# Altium schematic sheet PORTS.SchDoc
size A4
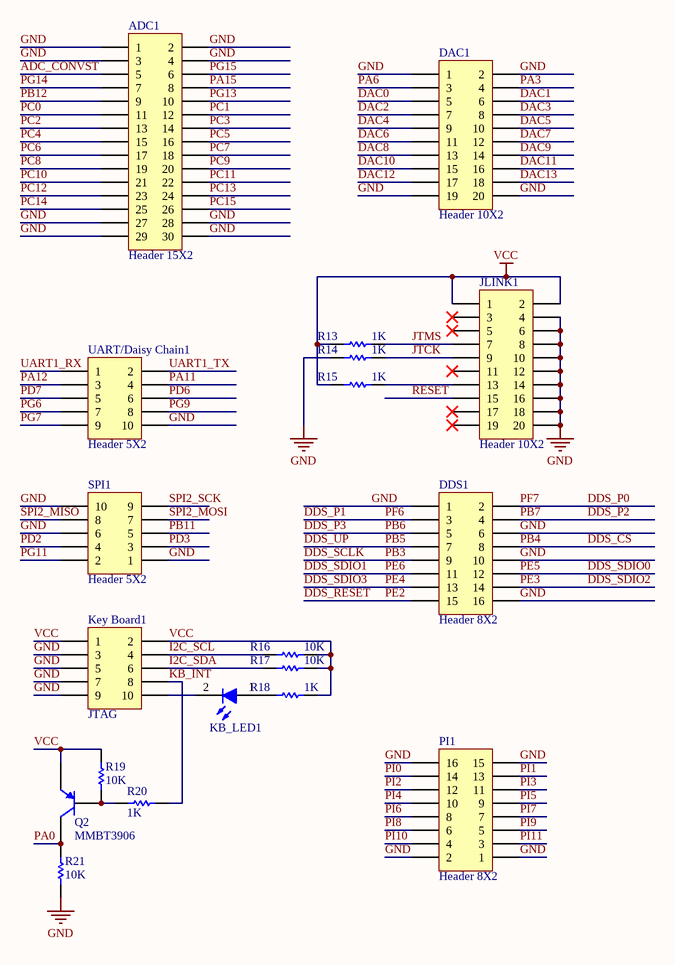
[diagram p0: PORTS.SchDoc]

## Parts
ADC1  Header 15X2  [HEADER15X2]
DAC1  Header 10X2  [HEADER10X2]
DDS1  Header 8X2  [Header8X2]
JLINK1  Header 10X2  [HEADER10X2]
KB_LED1  LED-BLUE  [0603LED_BLUE_V]  (value not drawn)
Key_Board1  JTAG  [HEADER5X2]
PI1  Header 8X2  [HEADER8X2]
Q2  MMBT3906  [SOT23_M]
R13  1K  [RESC0603(1608)_M]
R14  1K  [RESC0603(1608)_M]
R15  1K  [RESC0603(1608)_M]
R16  10K  [RESC0603(1608)_M]
R17  10K  [RESC0603(1608)_M]
R18  1K  [RESC0603(1608)_M]
R19  10K  [RESC0603(1608)_M]
R20  1K  [RESC0603(1608)_M]
R21  10K  [RESC0603(1608)_M]
SPI1  Header 5X2  [HEADER5X2]
UART/Daisy_Chain1  Header 5X2  [HEADER5X2]

## Nets
GND: ADC1.1 ADC1.2 ADC1.3 ADC1.4 ADC1.27 ADC1.28 ADC1.29 ADC1.30 DAC1.1 DAC1.2 DAC1.19 DAC1.20 DDS1.1 DDS1.6 DDS1.10 DDS1.16 JLINK1.4 JLINK1.6 JLINK1.8 JLINK1.10 JLINK1.12 JLINK1.14 JLINK1.16 JLINK1.18 JLINK1.20 Key_Board1.3 Key_Board1.5 Key_Board1.7 Key_Board1.9 PI1.1 PI1.2 PI1.15 PI1.16 R14.2 R21.1 SPI1.1 SPI1.6 SPI1.10 UART/Daisy_Chain1.10
VCC: JLINK1.1 JLINK1.2 Key_Board1.1 Key_Board1.2 Q2.2(E) R13.2 R15.2 R16.1 R17.1 R18.1 R19.2
ADC_CONVST: ADC1.5
DAC0: DAC1.5
DAC1: DAC1.6
DAC2: DAC1.7
DAC3: DAC1.8
DAC4: DAC1.9
DAC5: DAC1.10
DAC6: DAC1.11
DAC7: DAC1.12
DAC8: DAC1.13
DAC9: DAC1.14
DAC10: DAC1.15
DAC11: DAC1.16
DAC12: DAC1.17
DAC13: DAC1.18
DDS_CS: DDS1.8  [also labelled PB4]
DDS_P0: DDS1.2  [also labelled PF7]
DDS_P1: DDS1.3  [also labelled PF6]
DDS_P2: DDS1.4  [also labelled PB7]
DDS_P3: DDS1.5  [also labelled PB6]
DDS_RESET: DDS1.15  [also labelled PE2]
DDS_SCLK: DDS1.9  [also labelled PB3]
DDS_SDIO0: DDS1.12  [also labelled PE5]
DDS_SDIO1: DDS1.11  [also labelled PE6]
DDS_SDIO2: DDS1.14  [also labelled PE3]
DDS_SDIO3: DDS1.13  [also labelled PE4]
DDS_UP: DDS1.7  [also labelled PB5]
I2C_SCL: Key_Board1.4 R16.2
I2C_SDA: Key_Board1.6 R17.2
JTCK: JLINK1.9 R14.1
JTMS: JLINK1.7 R13.1
KB_INT: Key_Board1.8 R20.2
PA0: Q2.3(C) R21.2
PA3: DAC1.4
PA6: DAC1.3
PA11: UART/Daisy_Chain1.4
PA12: UART/Daisy_Chain1.3
PA15: ADC1.8
PB11: SPI1.5
PB12: ADC1.9
PC0: ADC1.11
PC1: ADC1.12
PC2: ADC1.13
PC3: ADC1.14
PC4: ADC1.15
PC5: ADC1.16
PC6: ADC1.17
PC7: ADC1.18
PC8: ADC1.19
PC9: ADC1.20
PC10: ADC1.21
PC11: ADC1.22
PC12: ADC1.23
PC13: ADC1.24
PC14: ADC1.25
PC15: ADC1.26
PD2: SPI1.4
PD3: SPI1.3
PD6: UART/Daisy_Chain1.6
PD7: UART/Daisy_Chain1.5
PG6: UART/Daisy_Chain1.7
PG7: UART/Daisy_Chain1.9
PG9: UART/Daisy_Chain1.8
PG11: SPI1.2
PG13: ADC1.10
PG14: ADC1.7
PG15: ADC1.6
PI0: PI1.14
PI1: PI1.13
PI2: PI1.12
PI3: PI1.11
PI4: PI1.10
PI5: PI1.9
PI6: PI1.8
PI7: PI1.7
PI8: PI1.6
PI9: PI1.5
PI10: PI1.4
PI11: PI1.3
RESET: JLINK1.15
SPI2_MISO: SPI1.8
SPI2_MOSI: SPI1.7
SPI2_SCK: SPI1.9
UART1_RX: UART/Daisy_Chain1.1
UART1_TX: UART/Daisy_Chain1.2
NetJLINK1_13: JLINK1.13 R15.1
NetKB_LED1_1: KB_LED1.1(A) R18.2
NetKB_LED1_2: KB_LED1.2(K) Key_Board1.10
NetQ2_1: Q2.1(B) R19.1 R20.1

Not connected (* = marked no-connect by the designer): JLINK1 3* 5* 11* 17* 19*

## Library data of the parts
ADC1 = Header 15X2: Header, 15-Pin, Dual row; LatestRevisionDate: 17-Jul-2002; LatestRevisionNote: Re-released for DXP Platform.; Publisher: Altium Limited
DAC1 JLINK1 = Header 10X2: Header, 10-Pin, Dual row; LatestRevisionDate: 17-Jul-2002; LatestRevisionNote: Re-released for DXP Platform.; Publisher: Altium Limited
DDS1 PI1 = Header 8X2: Header, 8-Pin, Dual row; LatestRevisionDate: 17-Jul-2002; LatestRevisionNote: Re-released for DXP Platform.; Publisher: Altium Limited
Key_Board1 = Header 5X2: Header, 5-Pin, Dual row; Manufacturer: Generic Components; Class: Connector
Q2 = MMBT3906: PNP General Purpose Amplifier; Published: 8-Jun-2000; LatestRevisionDate: 15-Jan-2003; LatestRevisionNote: PCB Footprint 'BCY-W3/D4.7' replaced; DatasheetVersion: 1997; PackageVersion: Sep-1998; PackageReference: TO-92A; Publisher: Altium Limited; PackageDescription: TO, Flat Index; 3 In-Line, Axial Leads; Body Dia. 4.5mm; Leads 0.51 x 0.48 mm (max); ComponentLink1Description: Manufacturer Link; ComponentLink1URL: http://www.fairchildsemi.com/; ComponentLink2Description: Datasheet; ComponentLink2URL: http://www.fairchildsemi.com/ds/2N%2F2N3906.pdf
R13-R21 = RES
SPI1 UART/Daisy_Chain1 = Header 5X2: Header, 5-Pin, Dual row; LatestRevisionDate: 17-Jul-2002; LatestRevisionNote: Re-released for DXP Platform.; Publisher: Altium Limited